# EasyEDA Pro project rtl_sdr_v1.eprj, schematic Schematic2
Create Date: 2023-01-15; Page Name: P1; Project Name: rtl_sdr_v1; Schematic Name: Schematic2; Update Date: 2023-02-09; Company: 嘉立创EDA; Page Size: A3; Version: V1.0
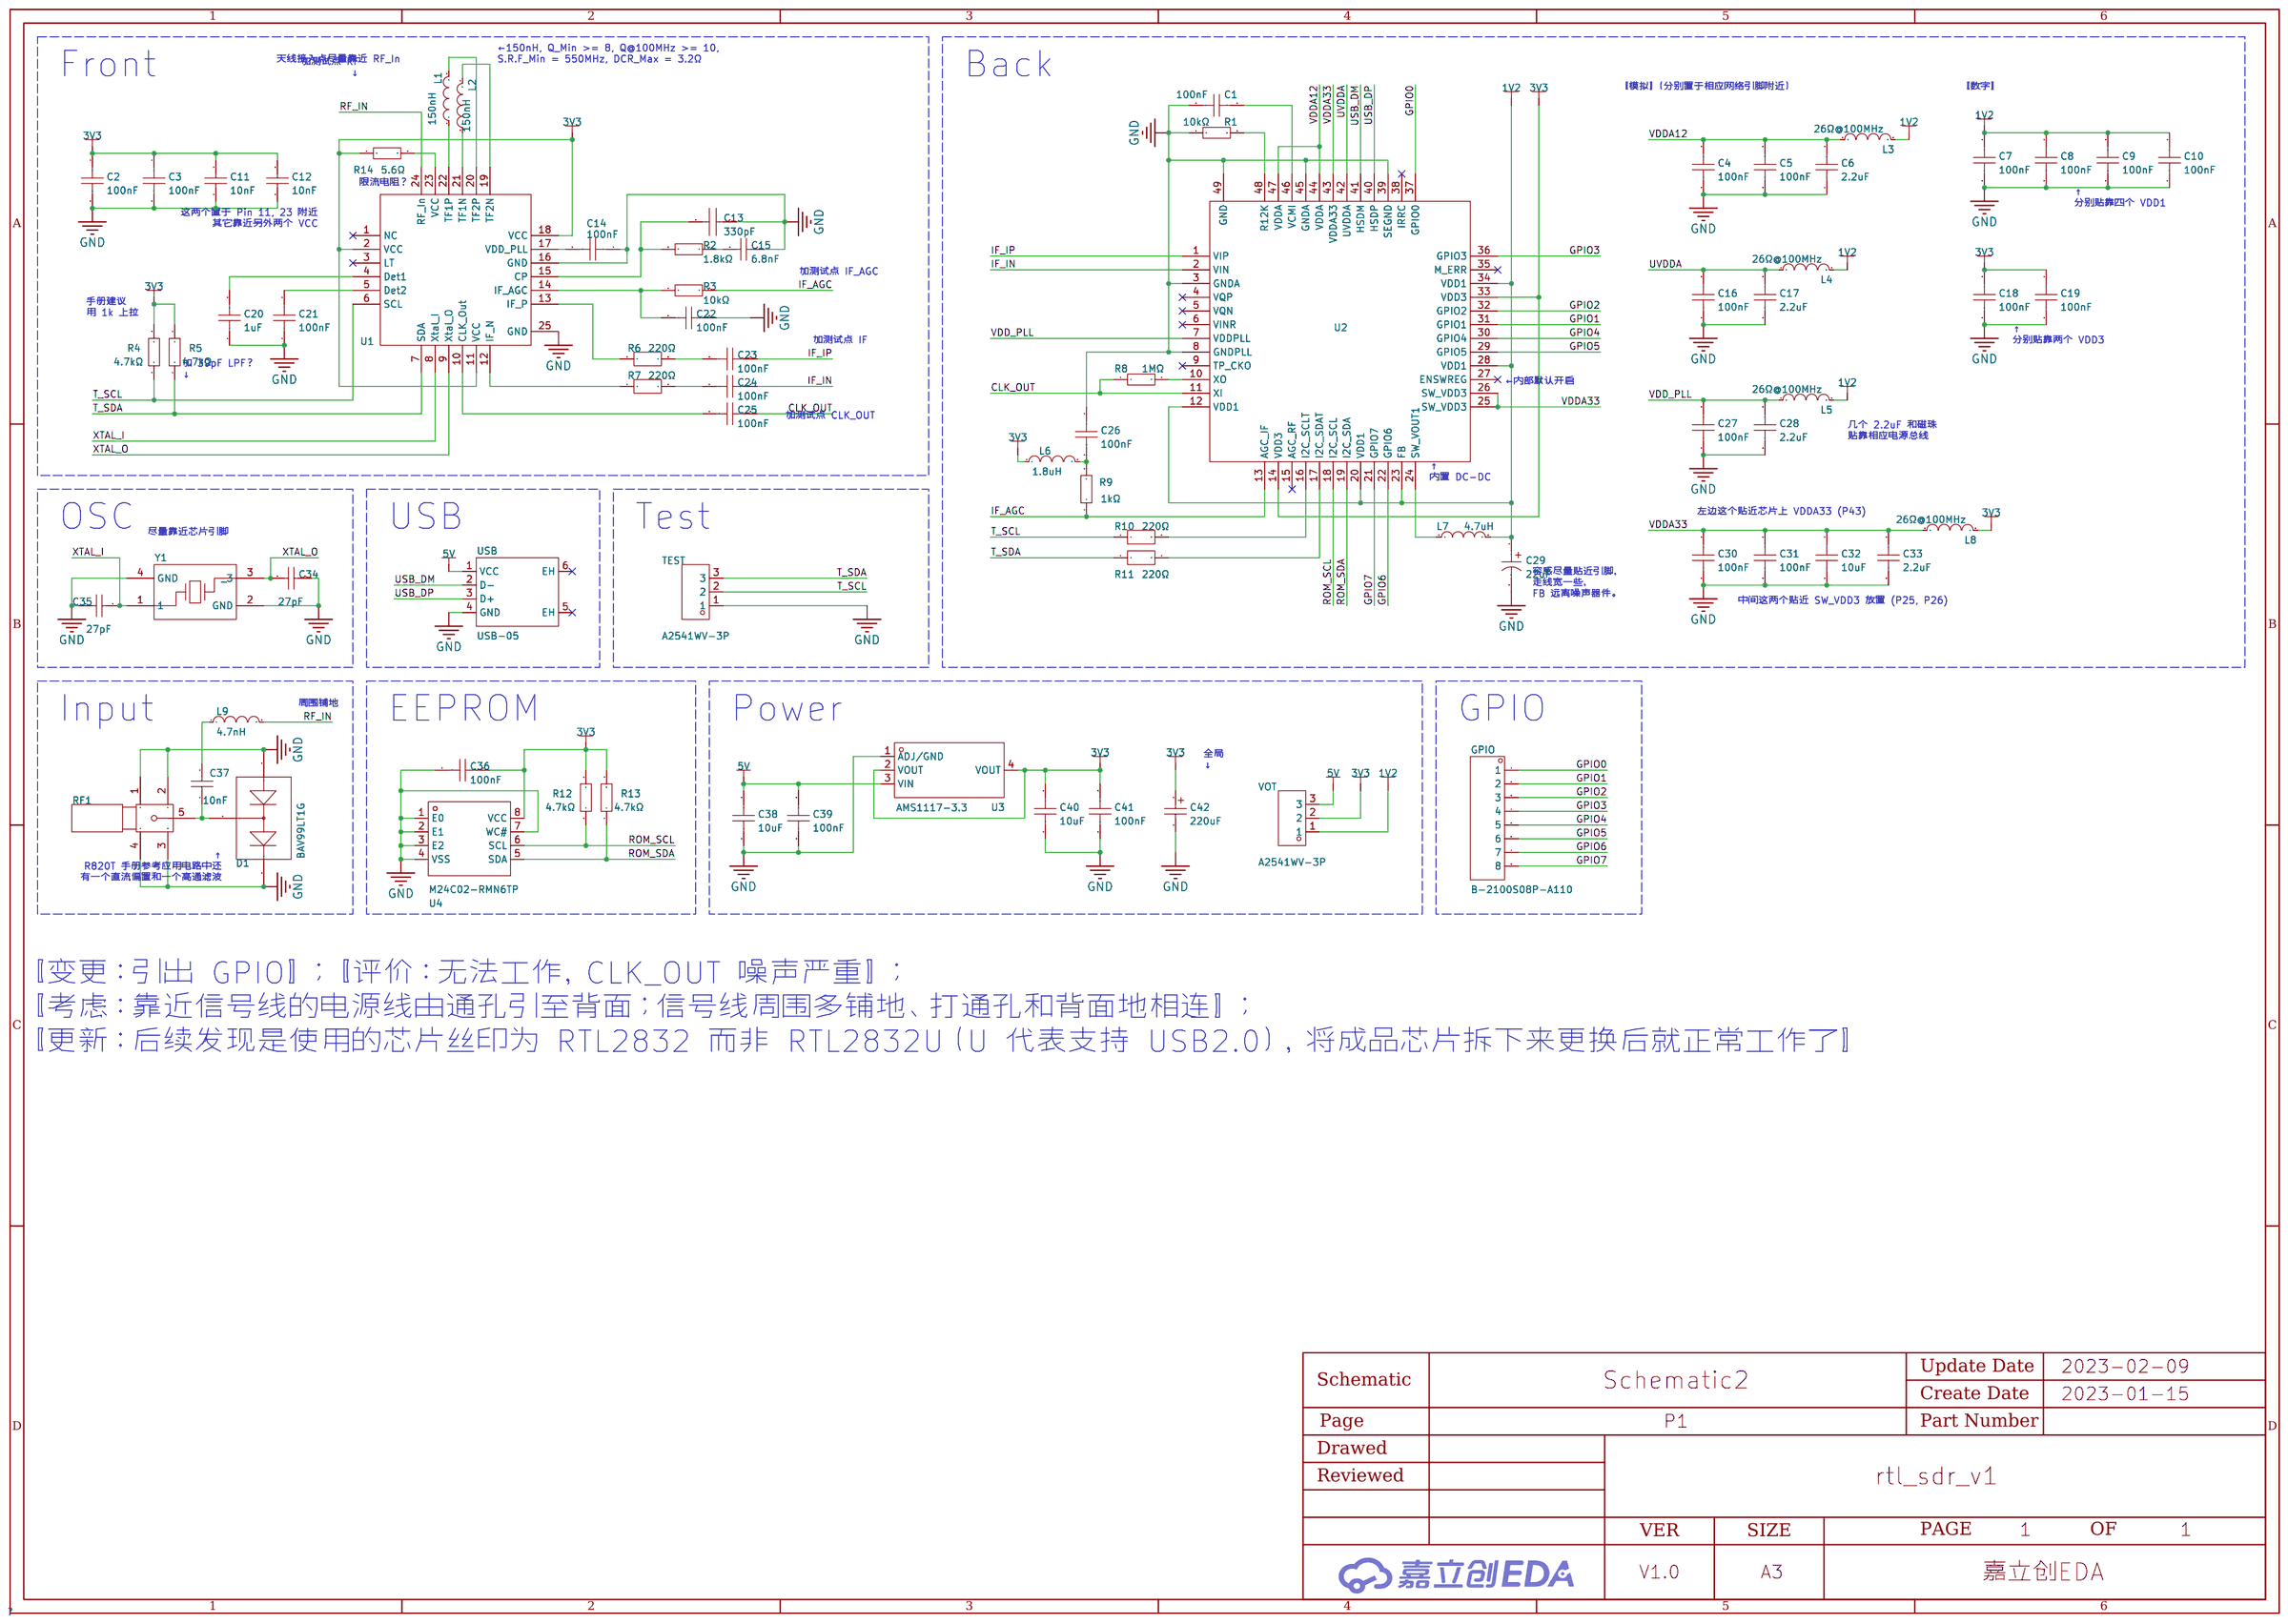
[diagram p1: schematic sheet]

## Parts
C1  100nF  [C0402]
C2  100nF  [C0402]
C3  100nF  [C0402]
C4  100nF  [C0402]
C5  100nF  [C0402]
C6  2.2uF  [C0402]
C7  100nF  [C0402]
C8  100nF  [C0402]
C9  100nF  [C0402]
C10  100nF  [C0402]
C11  10nF  [C0402]
C12  10nF  [C0402]
C13  330pF  [C0402]
C14  100nF  [C0402]
C15  6.8nF  [C0402]
C16  100nF  [C0402]
C17  2.2uF  [C0402]
C18  100nF  [C0402]
C19  100nF  [C0402]
C20  1uF  [C0402]
C21  100nF  [C0402]
C22  100nF  [C0402]
C23  100nF  [C0402]
C24  100nF  [C0402]
C25  100nF  [C0402]
C26  100nF  [C0402]
C27  100nF  [C0402]
C28  2.2uF  [C0402]
C29  22uF  [CAP-SMD_L3.5-W2.8-FD]
C30  100nF  [C0402]
C31  100nF  [C0402]
C32  10uF  [C0402]
C33  2.2uF  [C0402]
C34  27pF  [C0402]
C35  27pF  [C0402]
C36  100nF  [C0402]
C37  10nF  [C0402]
C38  10uF  [C0402]
C39  100nF  [C0402]
C40  10uF  [C0402]
C41  100nF  [C0402]
C42  220uF  [CAP-SMD_L7.3-W4.3-R-RD]
D1  BAV99LT1G  [SOT-23-3_L2.9-W1.3-P1.90-LS2.4-BR]
GPIO  B-2100S08P-A110  [HDR-TH_8P-P2.54-V-M]
L1  150nH  [L0603]
L2  150nH  [L0603]
L3  26Ω@100MHz  [L0402]
L4  26Ω@100MHz  [L0402]
L5  26Ω@100MHz  [L0402]
L6  1.8uH  [L0805]
L7  4.7uH  [L0402]
L8  26Ω@100MHz  [L0402]
L9  4.7nH  [L0402]
R1  10kΩ  [R0402]
R2  1.8kΩ  [R0402]
R3  10kΩ  [R0402]
R4  4.7kΩ  [R0402]
R5  4.7kΩ  [R0402]
R6  220Ω  [R0402]
R7  220Ω  [R0402]
R8  1MΩ  [R0402]
R9  1kΩ  [R0402]
R10  220Ω  [R0402]
R11  220Ω  [R0402]
R12  4.7kΩ  [R0402]
R13  4.7kΩ  [R0402]
R14  5.6Ω  [R0402]
RF1  DOSIN-806-0001  [CONN-TH_DOSIN-806-0001]
TEST  A2541WV-3P  [HDR-TH_3P-P2.54-V-M]
U1  -  [VQFN-24_L4.0-W4.0-P0.50-TL-EP2.8]
U2  -  [QFN-48_L6.0-W6.0-P0.40-BL-EP4.3]
U3  AMS1117-3.3  [SOT-223_L6.5-W3.5-P2.30-LS7.0-BR]
U4  M24C02-RMN6TP  [SOIC-8_L4.9-W3.9-P1.27-LS6.0-BL]
USB  USB-05  [USB-A-TH_48037-0001]
VOT  A2541WV-3P  [HDR-TH_3P-P2.54-V-M]
Y1  -  [28.8MHz]

## Library data of the parts
C1-C5 C7-C10 C14 C16 C18 C19 C21-C27 C30 C31 C36 C39 C41 = CL05B104KB54PNC: 容值:100nF;精度:±10%;额定电压:50V;材质(温度系数):X7R;; LCSC Part Name: 100nF ±10% 50V; Supplier Part: C307331; Manufacturer: SAMSUNG(三星); Supplier Footprint: 0402; JLCPCB Part Class: 基础库; Datasheet: https://atta.szlcsc.com/upload/public/pdf/source/20181009/C307331_222F7C870FD3EA5F46F538B483443886.pdf; Supplier: LCSC; Tolerance: ±10%; Voltage Rated: 50V; Temperature Coefficient: X7R
C6 C17 C28 C33 = CC0402KRX5R7BB225: 容值:2.2uF;精度:±10%;额定电压:16V;材质(温度系数):X5R;; LCSC Part Name: 2.2uF ±10% 16V; Supplier Part: C326556; Manufacturer: YAGEO(国巨); Supplier Footprint: 0402; JLCPCB Part Class: 扩展库; Datasheet: https://atta.szlcsc.com/upload/public/pdf/source/20181031/C326556_D2E9443E2F955406F9EF33158348E22D.pdf; Supplier: LCSC; Tolerance: ±10%; Voltage Rated: 16V; Temperature Coefficient: X5R
C11 C12 C37 = CL05B103KB5NNNC: 容值:10nF;精度:±10%;额定电压:50V;材质(温度系数):X7R;; LCSC Part Name: 10nF ±10% 50V; Supplier Part: C15195; Manufacturer: SAMSUNG(三星); Supplier Footprint: 0402; JLCPCB Part Class: 基础库; Datasheet: https://atta.szlcsc.com/upload/public/pdf/source/20160103/1457707674468.pdf; Supplier: LCSC; Tolerance: ±10%; Voltage Rated: 50V; Temperature Coefficient: X7R
C13 = CL05C331JB5NNNC: 容值:330pF;精度:±5%;额定电压:50V;材质(温度系数):C0G;; LCSC Part Name: 330pF ±5% 50V; Supplier Part: C13533; Manufacturer: SAMSUNG(三星); Supplier Footprint: 0402; JLCPCB Part Class: 基础库; Datasheet: https://atta.szlcsc.com/upload/public/pdf/source/20160103/1457707668517.pdf; Supplier: LCSC; Tolerance: ±5%; Voltage Rated: 50V; Temperature Coefficient: C0G
C15 = CC0402KRX7R9BB682: 容值:6.8nF;精度:±10%;额定电压:50V;材质(温度系数):X7R;; LCSC Part Name: 6.8nF ±10% 50V; Supplier Part: C93654; Manufacturer: YAGEO(国巨); Supplier Footprint: 0402; JLCPCB Part Class: 扩展库; Datasheet: https://atta.szlcsc.com/upload/public/pdf/source/20171226/C93654_15142609557301205664.pdf; Supplier: LCSC; Tolerance: ±10%; Voltage Rated: 50V; Temperature Coefficient: X7R
C20 = CL05A105KA5NQNC: 容值:1uF;精度:±10%;额定电压:25V;材质(温度系数):X5R;; LCSC Part Name: 1uF ±10% 25V; Supplier Part: C52923; Manufacturer: SAMSUNG(三星); Supplier Footprint: 0402; JLCPCB Part Class: 基础库; Datasheet: https://atta.szlcsc.com/upload/public/pdf/source/20160103/1457707735223.pdf; Supplier: LCSC; Tolerance: ±10%; Voltage Rated: 25V; Temperature Coefficient: X5R
C29 = CA45A-B-16V-22UF-K: 容值:22uF;精度:±10%;额定电压:16V;工作温度:-55℃~+125℃;; LCSC Part Name: 22uF ±10% 16V; Supplier Part: C2976913; Manufacturer: CEC(振华新云); Supplier Footprint: SMD,3.5x2.8x1.9mm; JLCPCB Part Class: 扩展库; Datasheet: https://atta.szlcsc.com/upload/public/pdf/source/20220222/C2C5F368BEBB90E653B4407F98E5644A.pdf; Supplier: LCSC; Tolerance: ±10%; Rated Voltage: 16V; Operating Temperature: -55℃~+125℃
C32 C38 C40 = CL05A106MP5NUNC: 容值:10uF;精度:±20%;额定电压:10V;材质(温度系数):X5R;; LCSC Part Name: 10uF ±20% 10V; Supplier Part: C315248; Manufacturer: SAMSUNG(三星); Supplier Footprint: 0402; JLCPCB Part Class: 扩展库; Datasheet: https://atta.szlcsc.com/upload/public/pdf/source/20200102/C478861_C4302703595930F3C0E62DAD3349F1AA.pdf; Supplier: LCSC; Tolerance: ±20%; Voltage Rated: 10V; Temperature Coefficient: X5R
C34 C35 = 0402CG270J500NT: 容值:27pF;精度:±5%;额定电压:50V;材质(温度系数):C0G;; LCSC Part Name: 27pF ±5% 50V; Supplier Part: C1557; Manufacturer: FH(风华); Supplier Footprint: 0402; JLCPCB Part Class: 基础库; Datasheet: https://atta.szlcsc.com/upload/public/pdf/source/20170923/C1557_1506149270123988364.pdf; Supplier: LCSC; Tolerance: ±5%; Voltage Rated: 50V; Temperature Coefficient: C0G
C42 = CA45-D010K227T: 容值:220uF;精度:±10%;额定电压:10V;等效串联电阻:500mΩ@100kHz;工作温度:-55℃~+125℃;; LCSC Part Name: 220uF ±10% 10V; Supplier Part: C123269; Manufacturer: 湘怡中元/湘江; Supplier Footprint: CASE-D_7343; JLCPCB Part Class: 扩展库; Datasheet: https://atta.szlcsc.com/upload/public/pdf/source/20181017/C123269_77F287277CDE9D02AA96C128D1DC6109.pdf; Supplier: LCSC; Tolerance: ±10%; Rated Voltage: 10V; Equivalent Series Resistance(ESR): 500mΩ@100kHz; Operating Temperature: -55℃~+125℃
D1 = BAV99LT1G: 二极管配置:1对串联式;功率:300mW;直流反向耐压(Vr):100V;平均整流电流(Io):215mA;正向压降(Vf):1.25V@150mA;反向电流(Ir):1uA@100V;反向恢复时间(trr):6ns;工作温度:-65℃~+150℃@(Tj);; LCSC Part Name: 100 V 开关二极管，双，串联; Supplier Part: C82480; Manufacturer: onsemi(安森美); Supplier Footprint: SOT-23; JLCPCB Part Class: 扩展库; Datasheet: https://atta.szlcsc.com/upload/public/pdf/source/20161024/1477288454129.PDF; Supplier: LCSC; Diode Configuration: 1对串联式; Power Dissipation: 300mW; Reverse Voltage (Vr): 100V; Average Rectified Current (Io): 215mA; Forward Voltage (Vf@If): 1.25V@150mA; Reverse Leakage Current: 1uA@100V; Reverse Recovery Time (trr): 6ns; Operating Temperature: -65℃~+150℃@(Tj)
GPIO = B-2100S08P-A110: 排数:单排;总PIN位数:8;间距:2.54mm;插针结构:1x8P;行距:-;安装类型:直插;圆针/方针:-;额定电流:-;额定电压:-;配合针长度:6mm;塑高:2.54mm;端接针长度:3mm;触头材质:黄铜;触头镀层:-;工作温度范围:-40℃~+105℃;颜色:黑色;; LCSC Part Name: 2.54mm 1x8P 直插; Supplier Part: C124381; Manufacturer: Ckmtw(灿科盟); Supplier Footprint: 直插,P=2.54mm; JLCPCB Part Class: 扩展库; Datasheet: https://atta.szlcsc.com/upload/public/pdf/source/20170821/C124381_1503303309126901535.pdf; Supplier: LCSC; Number of Rows: 单排; Number of Pins: 8; Pitch: 2.54mm; Pin Structure: 1x8P; Mounting Type: 直插; Length of Mating Pin: 6mm; Insulation Height: 2.54mm; Length of End Connection Pin: 3mm; Contact Material: 黄铜; Operating Temperature Range: -40℃~+105℃; Color: 黑色
L1 L2 = CLH1608T-R15K-S: 电感值:150nH;精度:±10%;额定电流:250mA;饱和电流(Isat):-;直流电阻(DCR):1.7Ω;; LCSC Part Name: 150nH ±10% 1.7Ω; Supplier Part: C285970; Manufacturer: chilisin(奇力新); Supplier Footprint: 0603; JLCPCB Part Class: Extended Part; Datasheet: https://atta.szlcsc.com/upload/public/pdf/source/20181024/C285970_0668A297EED728CEC7DA514144EDFAD9.pdf; Supplier: LCSC; Tolerance: ±10%; Rated Current: 250mA; DC Resistance (DCR): 1.7Ω; Q @ Freq: 8@50MHz; Frequency - Self Resonant: 550MHz
L3-L5 L8 = CBG100505U260T_C668229: 标称阻抗@测试频率:26Ω@100MHz;误差:±25%;直流电阻(RDC):150mΩ;额定电流:300mA;电路数:1;; LCSC Part Name: 26Ω@100MHz ±25%; Supplier Part: C668229; Manufacturer: FH(风华); Manufacturer Part: CBG100505U260T; Supplier Footprint: 0402; JLCPCB Part Class: 扩展库; Datasheet: https://atta.szlcsc.com/upload/public/pdf/source/20161217/1481939213023.pdf; Supplier: LCSC; Tolerance: ±25%; DC Resistance: 150mΩ; Current Rating: 300mA; Circuits: 1
L6 = MGFI2012C1R8KT-LF: 直流电阻(DCR):600mΩ;电感值:1.8uH;精度:±10%;额定电流:50mA;; LCSC Part Name: 1.8uH ±10%; Supplier Part: C281091; Manufacturer: microgate(麦捷科技); Supplier Footprint: 0805; JLCPCB Part Class: 扩展库; Datasheet: https://atta.szlcsc.com/upload/public/pdf/source/20181025/C281091_C9A7DB4DA521F4CDFC481A93B89090F5.pdf; Supplier: LCSC; DC Resistance (DCR): 600mΩ; Tolerance: ±10%; Rated Current: 50mA
L7 = MLZ1005N4R7LTD25: 电感值:4.7uH;精度:±20%;额定电流:-;饱和电流(Isat):-;直流电阻(DCR):-;; LCSC Part Name: 4.7uH ±20%; Supplier Part: C404795; Manufacturer: TDK; Supplier Footprint: 0402; JLCPCB Part Class: 扩展库; Datasheet: https://atta.szlcsc.com/upload/public/pdf/source/20190722/C404795_AC5F02D6580F63BF636960C003744397.pdf; Supplier: LCSC; Tolerance: ±20%
L9 = CH1608H4N7S(f): 电感值:4.7nH;精度:±0.3nH;额定电流:500mA;饱和电流(Isat):-;直流电阻(DCR):200mΩ;; LCSC Part Name: 4.7nH ±0.3nH 130mΩ; Supplier Part: C145035; Manufacturer: Sunlord(顺络); Manufacturer Part: HQ1005C4N7ST; Supplier Footprint: 0402; JLCPCB Part Class: 扩展库; Datasheet: https://atta.szlcsc.com/upload/public/pdf/source/20210916/8B3EFCB70F1FDB1D95842A60A22D8C62.pdf; Supplier: LCSC; Tolerance: ±0.3nH; Rated Current: 600mA; DC Resistance (DCR): 130mΩ
R1 R3 = 0402WGF1002TCE: 电阻类型:厚膜电阻;阻值:10kΩ;精度:±1%;功率:62.5mW;温度系数:±100ppm/℃;最大工作电压:50V;工作温度范围:-55℃~+155℃;; LCSC Part Name: 10kΩ ±1% 62.5mW; Supplier Part: C25744; Manufacturer: UNI-ROYAL(厚声); Supplier Footprint: 0402; JLCPCB Part Class: 基础库; Datasheet: https://atta.szlcsc.com/upload/public/pdf/source/20200306/C422600_1E6D84923E4A46A82E41ADD87F860B5C.pdf; Supplier: LCSC; Type: 厚膜电阻; Tolerance: ±1%; Power(Watts): 62.5mW; Temperature Coefficient: ±100ppm/℃; Overload Voltage (Max): 50V; Operating Temperature Range: -55℃~+155℃
R2 = RN731ETTP1801B25: 阻值:1.8kΩ;精度:±0.1%;功率:63mW;最大工作电压:50V;工作温度范围:-55℃~+155℃;; LCSC Part Name: 1.8kΩ ±0.1% 63mW; Supplier Part: C186331; Manufacturer: KOA; Supplier Footprint: 0402; JLCPCB Part Class: 扩展库; Datasheet: https://atta.szlcsc.com/upload/public/pdf/source/20181223/C186331_CF2981600974339F0E9C61158F0B5119.pdf; Supplier: LCSC; Tolerance: ±0.1%; Power(Watts): 63mW; Overload Voltage (Max): 50V; Operating Temperature Range: -55℃~+155℃
R4 R5 R12 R13 = AC0402JR-074K7L: 电阻类型:厚膜电阻;阻值:4.7kΩ;精度:±5%;功率:62.5mW;温度系数:±100ppm/℃;最大工作电压:50V;工作温度范围:-55℃~+155℃;; LCSC Part Name: 4.7kΩ ±5% 62.5mW; Supplier Part: C144709; Manufacturer: YAGEO(国巨); Supplier Footprint: 0402; JLCPCB Part Class: 扩展库; Datasheet: https://atta.szlcsc.com/upload/public/pdf/source/20171221/C144709_15138311615541195382.pdf; Supplier: LCSC; Type: 厚膜电阻; Tolerance: ±5%; Power(Watts): 62.5mW; Temperature Coefficient: ±100ppm/℃; Overload Voltage (Max): 50V; Operating Temperature Range: -55℃~+155℃
R6 R7 R10 R11 = 0402 ±5% 220Ω: 电阻类型:厚膜电阻;阻值:220Ω;精度:±5%;功率:62.5mW;温度系数:±100ppm/℃;最大工作电压:50V;工作温度范围:-55℃~+155℃;; LCSC Part Name: 220Ω ±5% 62.5mW; Supplier Part: C2889365; Manufacturer: VO(翔胜); Supplier Footprint: 0402; JLCPCB Part Class: 扩展库; Datasheet: https://atta.szlcsc.com/upload/public/pdf/source/20210902/777BF6DFB3B29B13210374B07BC23D84.pdf; Supplier: LCSC; Type: 厚膜电阻; Tolerance: ±5%; Power(Watts): 62.5mW; Temperature Coefficient: ±100ppm/℃; Overload Voltage (Max): 50V; Operating Temperature Range: -55℃~+155℃
R8 = AC0402JR-071ML: 电阻类型:厚膜电阻;阻值:1MΩ;精度:±5%;功率:62.5mW;温度系数:±100ppm/℃;最大工作电压:50V;工作温度范围:-55℃~+155℃;; LCSC Part Name: 1MΩ ±5% 62.5mW; Supplier Part: C144725; Manufacturer: YAGEO(国巨); Supplier Footprint: 0402; JLCPCB Part Class: 扩展库; Datasheet: https://atta.szlcsc.com/upload/public/pdf/source/20180126/C144725_15169560686611309176.pdf; Supplier: LCSC; Type: 厚膜电阻; Tolerance: ±5%; Power(Watts): 62.5mW; Temperature Coefficient: ±100ppm/℃; Overload Voltage (Max): 50V; Operating Temperature Range: -55℃~+155℃
R9 = RC0402JR-071KL: 阻值:1kΩ;精度:±5%;功率:62.5mW;温度系数:±100ppm/℃;最大工作电压:50V;工作温度范围:-55℃~+155℃;; LCSC Part Name: 1kΩ ±5% 62.5mW; Supplier Part: C105637; Manufacturer: YAGEO(国巨); Supplier Footprint: 0402; JLCPCB Part Class: 扩展库; Datasheet: https://atta.szlcsc.com/upload/public/pdf/source/20170518/1495085707603.pdf; Supplier: LCSC; Tolerance: ±5%; Power(Watts): 62.5mW; Temperature Coefficient: ±100ppm/℃; Overload Voltage (Max): 50V; Operating Temperature Range: -55℃~+155℃
R14 = HPCR0402F5R60K9: 电阻类型:厚膜电阻;阻值:5.6Ω;精度:±1%;功率:100mW;温度系数:±100ppm/℃;最大工作电压:50V;工作温度范围:-55℃~+125℃;; LCSC Part Name: 5.6Ω ±1% 100mW; Supplier Part: C365035; Manufacturer: RESI(开步睿思）; Supplier Footprint: 0402; JLCPCB Part Class: 扩展库; Datasheet: https://atta.szlcsc.com/upload/public/pdf/source/20190129/C365035_D62334E3E9B4E82E18E7DD3552CCD760.pdf; Supplier: LCSC; Type: 厚膜电阻; Tolerance: ±1%; Power(Watts): 100mW; Temperature Coefficient: ±100ppm/℃; Overload Voltage (Max): 50V; Operating Temperature Range: -55℃~+125℃
RF1 = DOSIN-806-0001: 连接器类型:板端;射频系列:SMA;接口类型:内孔;端口数量:1;阻抗:50Ω;频率-最大值:6GHz;样式:弯头;接口直径:-;接口长度/高度:-;工作温度范围:-55℃~+155℃;; LCSC Part Name: SMA 内孔 弯头 1代 三件套; Supplier Part: C521220; Manufacturer: dosinconn(德索五金); Supplier Footprint: 插件; JLCPCB Part Class: 扩展库; Datasheet: https://atta.szlcsc.com/upload/public/pdf/source/20200430/C521220_C6031DDAF0FAF0D055B4D3A6CEEB8EE9.pdf; Supplier: LCSC; Connector Type: 板端; RF Series: SMA; Interface Type: 内孔; Number of Ports: 1; Impedance: 50Ω; Frequency-Max: 6GHz; Style: 弯头; Operating Temperature Range: -55℃~+155℃
TEST VOT = A2541WV-3P_1: Supplier Part: C5295980; Manufacturer: CJT(长江连接器); Supplier Footprint: 插件,P=2.54mm; Datasheet: https://atta.szlcsc.com/upload/public/pdf/source/20190522/C339348_148DC62DFEE35B66DE27661541078F4A.pdf; Supplier: LCSC
U1 = R820T2
U2 = RTL2832U
U3 = AMS1117-3.3_C426566: 输出类型:固定;输出极性:正;输出通道数:1;最大输入电压:18V;输出电压:3.3V;压差:1.4V@(1A);输出电流:1A;电源纹波抑制比(PSRR):70dB@(120Hz);; LCSC Part Name: 正 Vin=18V Vout=3.3V 1A 70dB@(120Hz); Supplier Part: C426566; Manufacturer: Slkor(萨科微); Supplier Footprint: SOT-223; JLCPCB Part Class: 扩展库; Datasheet: https://atta.szlcsc.com/upload/public/pdf/source/20201231/C426566_7F22DB93439D00F3FA27143E4F28C6AA.pdf; Supplier: LCSC; Output Type: 固定; Output Polarity: 正; Number of Outputs: 1; Maximum Input Voltage: 18V; Output Voltage: 3.3V; Dropout Voltage: 1.4V@(1A); Output Current: 1A; Power Supply Rejection Ratio (PSRR): 70dB@(120Hz)
U4 = M24C02-RMN6TP: 工作电压：1.8V to 5.5V ，EEPROM芯片， 存储芯片，容量： 2-Kbit(256 x 8bit)，I2C接口; Supplier Part: C83836; Manufacturer: ST(意法半导体); Supplier Footprint: SOIC-8; JLCPCB Part Class: 扩展库; Datasheet: https://atta.szlcsc.com/upload/public/pdf/source/20170515/1494827295722.pdf; Supplier: LCSC
USB = USB-05: 连接器类型:Type-A;标准:USB 2.0;公母:公头;触点数量:4;端口数量:1;额定电流 - 电源:-;; LCSC Part Name: Type-A 公头; Supplier Part: C112454; Manufacturer: SOFNG(硕方); Supplier Footprint: 插件; JLCPCB Part Class: 扩展库; Datasheet: https://atta.szlcsc.com/upload/public/pdf/source/20220615/298FC7EF95355C4E82516C7899B405E9.pdf; Supplier: LCSC; Connector Type: Type-A; Standard: USB 2.0; Gender: 公头; Number of Contacts: 4; Number of Ports: 1
Y1 = 28.8MHz

## Nets
1V2: C7.1 C8.1 C9.1 C10.1 C29.1 L3.2 L4.2 L5.2 L7.2 U2.12(VDD1) U2.20(VDD1) U2.23(FB) U2.28(VDD1) U2.34(VDD1) VOT.1
3V3: C2.1 C3.1 C11.2 C12.2 C18.1 C19.1 C36.1 C40.2 C41.2 C42.1 L6.1 L8.2 R4.2 R5.2 R12.2 R13.2 R14.1 U1.2(VCC) U1.11(VCC) U1.18(VCC) U2.14(VDD3) U2.33(VDD3) U3.2(VOUT) U3.4(VOUT) U4.8(VCC) VOT.2
5V: C38.2 C39.2 U3.3(VIN) USB.1(VCC) VOT.3
GND: C1.2 C2.2 C3.2 C4.1 C5.1 C6.1 C7.2 C8.2 C9.2 C10.2 C11.1 C12.1 C13.1 C14.1 C15.1 C16.1 C17.1 C18.2 C19.2 C20.1 C21.2 C22.2 C26.1 C27.1 C28.1 C29.2 C30.1 C31.2 C32.2 C33.1 C34.2 C35.1 C36.2 C38.1 C39.1 C40.1 C41.1 C42.2 D1.1 D1.2 R1.1 RF1.1 RF1.2 RF1.3 RF1.4 TEST.1 U1.16(GND) U1.25(GND) U2.3(GNDA) U2.8(GNDPLL) U2.39(SEGND) U2.45(GNDA) U2.49(GND) U3.1(ADJ/GND) U4.1(E0) U4.2(E1) U4.3(E2) U4.4(VSS) U4.7(WC#) USB.4(GND) Y1.2(GND) Y1.4(GND)
VDD_PLL: C27.2 C28.2 L5.1 U2.7(VDDPLL)
VDDA12: C4.2 C5.2 C6.2 L3.1 U2.44(VDDA) U2.47(VDDA)
VDDA33: C30.2 C31.1 C32.1 C33.2 L8.1 U2.25(SW_VDD3) U2.26(SW_VDD3) U2.43(VDDA33)
CLK_OUT: C25.2 R8.1 U2.11(XI)
GPIO0: GPIO.1 U2.37(GPIO0)
GPIO1: GPIO.2 U2.31(GPIO1)
GPIO2: GPIO.3 U2.32(GPIO2)
GPIO3: GPIO.4 U2.36(GPIO3)
GPIO4: GPIO.5 U2.30(GPIO4)
GPIO5: GPIO.6 U2.29(GPIO5)
GPIO6: GPIO.7 U2.22(GPIO6)
GPIO7: GPIO.8 U2.21(GPIO7)
IF_AGC: R3.2 R9.1 U2.13(AGC_IF)
IF_IN: C24.2 U2.2(VIN)
IF_IP: C23.2 U2.1(VIP)
RF_IN: L9.2 U1.24(RF_In)
ROM_SCL: R12.1 U2.18(I2C_SCL) U4.6(SCL)
ROM_SDA: R13.1 U2.19(I2C_SDA) U4.5(SDA)
T_SCL: R4.1 R10.1 TEST.2 U1.6(SCL)
T_SDA: R5.1 R11.1 TEST.3 U1.7(SDA)
USB_DM: U2.41(HSDM) USB.2(D-)
USB_DP: U2.40(HSDP) USB.3(D+)
UVDDA: C16.2 C17.2 L4.1 U2.42(UVDDA)
XTAL_I: C35.2 U1.8(Xtal_I) Y1.1
XTAL_O: C34.1 U1.9(Xtal_O) Y1.3( 3)
$1N1594: C37.1 D1.3 RF1.5
$1N1930: C37.2 L9.1
$1N6838: C21.1 U1.5(Det2)
$1N6851: C20.2 U1.4(Det1)
$1N11372: L1.1 U1.22(TF1P)
$1N11392: L1.2 U1.20(TF2P)
$1N12305: L2.1 U1.19(TF2N)
$1N12306: L2.2 U1.21(TF1N)
$1N15211: C23.1 R6.2
$1N15347: C24.1 R7.2
$1N15700: C22.1 R3.1 U1.14(IF_AGC)
$1N16619: C13.2 R2.2 U1.15(CP)
$1N16902: C14.2 U1.17(VDD_PLL)
$1N17181: C15.2 R2.1
$1N18448: R6.1 U1.13(IF_P)
$1N18481: R7.1 U1.12(IF_N)
$1N21853: C25.1 U1.10(CLK_Out)
$1N26222: R8.2 U2.10(XO)
$1N27944: R10.2 U2.16(I2C_SCLT)
$1N27983: R11.2 U2.17(I2C_SDAT)
$1N40591: R1.2 U2.48(R12K)
$1N40849: C1.1 U2.46(VCMI)
$1N44263: C26.2 L6.2 R9.2
$1N51858: L7.1 U2.24(SW_VOUT1)
$1N92956: R14.2 U1.23(VCC)

Not connected (* = marked no-connect by the designer): U1 1(NC)* 3(LT)*; U2 4(VQP)* 5(VQN)* 6(VINR)* 9(TP_CKO)* 15(AGC_RF)* 27(ENSWREG)* 35(M_ERR)* 38(IRRC)*; USB 5(EH)* 6(EH)*

## Notes on the sheet
- Front
- 天线接入点尽量靠近 RF_In
- ←150nH, Q_Min >= 8, Q@100MHz >= 10,
  S.R.F_Min = 550MHz, DCR_Max = 3.2Ω
- Back
- 加测试点 RF
  ↓
- 【模拟】（分别置于相应网络引脚附近）
- 【数字】
- 限流电阻？
- ↑
  分别贴靠四个 VDD1
- 这两个置于 Pin 11, 23 附近
  其它靠近另外两个 VCC
- 加测试点 IF_AGC
- 手册建议
  用 1k 上拉
- 加测试点 IF
- ↑
  分别贴靠两个 VDD3
- 加 39pF LPF？
  ↓
- ←内部默认开启
- 加测试点 CLK_OUT
- 几个 2.2uF 和磁珠
  贴靠相应电源总线
- ↑
  内置 DC-DC
- OSC
- USB
- Test
- 左边这个贴近芯片上 VDDA33 (P43)
- 尽量靠近芯片引脚
- 容感尽量贴近引脚，
  走线宽一些，
  FB 远离噪声器件。
- 中间这两个贴近 SW_VDD3 放置 (P25, P26)
- Input
- EEPROM
- Power
- GPIO
- 周围铺地
- 全局
  ↓
- ↑
  R820T 手册参考应用电路中还
  有一个直流偏置和一个高通滤波
- 【变更：引出 GPIO】；【评价：无法工作，CLK_OUT 噪声严重】；
  【考虑：靠近信号线的电源线由通孔引至背面；信号线周围多铺地、打通孔和背面地相连】；
  【更新：后续发现是使用的芯片丝印为 RTL2832 而非 RTL2832U（U 代表支持 USB2.0），将成品芯片拆下来更换后就正常工作了】
